# Altium schematic sheet Sheet1.SchDoc
size A4; SheetNumber: 1; SheetTotal: 1
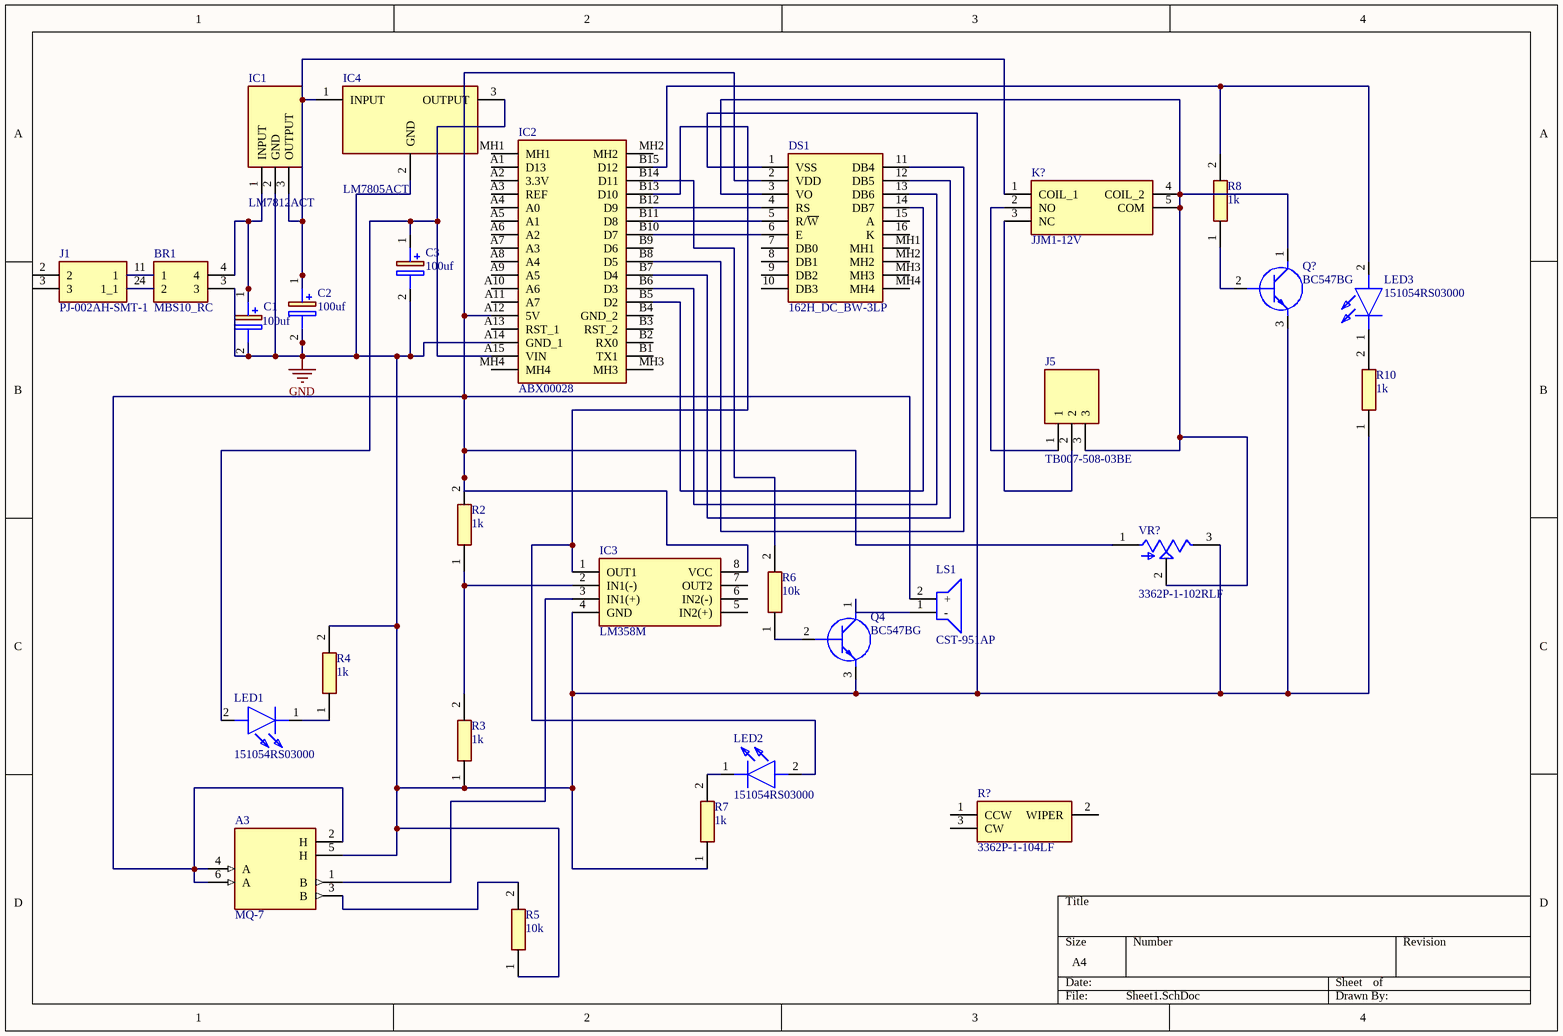
[diagram p0: Sheet1.SchDoc]

## Parts
A3  MQ-7  [XDCR_MQ-7]
BR1  MBS10_RC  [SOP240P690X290-4N]
C1  100uf  [CAPPRD500W65D1250H2700]
C2  100uf  [CAPPRD500W65D1250H2700]
C3  100uf  [CAPPRD500W65D1250H2700]
DS1  162H_DC_BW-3LP  [162HDCBW3LP]
IC1  LM7812ACT  [TO254P470X1016X2019-3P]
IC2  ABX00028  [ABX00028]
IC3  LM358M  [SOIC127P600X175-8N]
IC4  LM7805ACT  [TO254P470X1016X2019-3P]
J1  PJ-002AH-SMT-1  [PJ002AHSMT1]
J5  TB007-508-03BE  [CUI_TB007-508-03BE]
K?  JJM1-12V  [JJM112V]
LED1  151054RS03000  [151054RS03000]
LED2  151054RS03000  [151054RS03000]
LED3  151054RS03000  [151054RS03000]
LS1  CST-951AP  [CST951AP]
Q4  BC547BG  [TO-92_(TO-226)]
Q?  BC547BG  [TO-92_(TO-226)]
R2  1k  [RESAD1987W56L1031D239]
R3  1k  [RESAD1987W56L1031D239]
R4  1k  [RESAD1987W56L1031D239]
R5  10k  [RESAD1987W56L1031D239]
R6  10k  [RESAD1987W56L1031D239]
R7  1k  [RESAD1987W56L1031D239]
R8  1k  [RESAD1987W56L1031D239]
R10  1k  [RESAD1987W56L1031D239]
R?  3362P-1-104LF  [3362P_1]
VR?  3362P-1-102RLF  [TRIM_3362P-1-102RLF]

## Nets
GND: A3.5(H) BR1.3 C1.2(-) C2.2(-) C3.2(-) DS1.1(VSS) IC1.2(GND) IC2.A14(GND_1) IC3.4(GND) IC4.2(GND) Q4.3(E) Q?.3(E) R3.1 R4.2 R5.1 R7.1 R10.1 VR?.3(CW)
NetA3_1: A3.1(B) IC3.3(IN1(+))
NetA3_2: A3.2(H) A3.4(A) A3.6(A) DS1.2(VDD) IC2.A12(5V) IC3.8(VCC) LS1.2(+) R2.2 VR?.1(CCW)
NetA3_3: A3.3(B) R5.2
NetBR1_1: BR1.1 J1.1
NetBR1_2: BR1.2 J1.4(1_1)
NetBR1_4: BR1.4 C1.1(+) IC1.1(INPUT)
NetC2_1: C2.1(+) IC1.3(OUTPUT) IC4.1(INPUT) K?.1(COIL_1)
NetC3_1: C3.1(+) IC2.A15(VIN) IC4.3(OUTPUT) LED1.2(A)
NetDS1_3: DS1.3(VO) J5.3 K?.4(COIL_2) K?.5(COM) Q?.1(C) VR?.2(WIPER)
NetDS1_4: DS1.4(RS) IC2.B12(D9)
NetDS1_5: DS1.5(R/~{W}) IC2.B11(D8)
NetDS1_6: DS1.6(E) IC2.B10(D7)
NetDS1_11: DS1.11(DB4) IC2.B8(D5)
NetDS1_12: DS1.12(DB5) IC2.B7(D4)
NetDS1_13: DS1.13(DB6) IC2.B6(D3)
NetDS1_14: DS1.14(DB7) IC2.B5(D2)
NetIC2_B13: IC2.B13(D10) IC3.1(OUT1) LED2.2(A)
NetIC2_B14: IC2.B14(D11) R6.2
NetIC2_B15: IC2.B15(D12) LED3.2(A) R8.2
NetIC3_2: IC3.2(IN1(-)) R2.1 R3.2
NetJ5_1: J5.1 K?.2(NO)
NetJ5_2: J5.2 K?.3(NC)
NetLED1_1: LED1.1(K) R4.1
NetLED2_1: LED2.1(K) R7.2
NetLED3_1: LED3.1(K) R10.2
NetLS1_1: LS1.1(-) Q4.1(C)
NetQ4_2: Q4.2(B) R6.1
NetQ?_2: Q?.2(B) R8.1

Not connected (* = marked no-connect by the designer): DS1 7(DB0) 8(DB1) 9(DB2) 10(DB3) 15(A) 16(K) MH1 MH2 MH3 MH4; IC2 A1(D13) A2(3.3V) A3(REF) A4(A0) A5(A1) A6(A2) A7(A3) A8(A4) A9(A5) A10(A6) A11(A7) A13(RST_1) B1(TX1) B2(RX0) B3(RST_2) B4(GND_2) B9(D6) MH1 MH2 MH3 MH4; IC3 5(IN2(+)) 6(IN2(-)) 7(OUT2); J1 2 3; R? 1(CCW) 2(WIPER) 3(CW)

## Library data of the parts
A3 = MQ-7: Gas Sensor, High sensitivity to carbon monoxide; MF: Hanwei Electronics Co., Ltd; Price: None; Availability: Unavailable; MP: MQ-7; Package: Package; SnapEDA_Link: https://www.snapeda.com/parts/MQ-7/Hanwei%20Electronics%20Co.,%20Ltd/view-part/5661821/?ref=snap; Check_prices: https://www.snapeda.com/parts/MQ-7/Hanwei%20Electronics%20Co.,%20Ltd/view-part/5661821/?ref=eda; Value: *
BR1 = MBS10_RC: Bridge Rectifier; Manufacturer_Name: Taiwan Semiconductor; Manufacturer_Part_Number: MBS10 RC; Height: 2.9mm; Mouser Part Number: N/A; Mouser Price/Stock: https://www.mouser.com/Search/Refine.aspx?Keyword=N%2FA; Arrow Part Number: MBS10 RC; Arrow Price/Stock: https://www.arrow.com/en/products/mbs10rc/taiwan-semiconductor?region=nac
C1-C3 = EEUTA1E102LB: Capacitor Polarised; Manufacturer_Name: Panasonic; Datasheet Link: http://industrial.panasonic.com/cdbs/www-data/pdf/RDF0000/ABA0000C1212.pdf; Height: 27mm; Manufacturer_Part_Number: EEUTA1E102LB
DS1 = 162H_DC_BW-3LP: Display; Manufacturer_Name: Displaytech; Manufacturer_Part_Number: 162H DC BW-3LP; Datasheet Link: https://www.mouser.com/datasheet/2/1015/162H-DC-BW-3LP-Displaytech-Spec-1664822.pdf; Height: 13.2mm; Mouser Part Number: 758-162HDCBW3LP; Mouser Price/Stock: https://www.mouser.co.uk/ProductDetail/Displaytech/162H-DC-BW-3LP?qs=PzGy0jfpSMu9Pu07wP3dWg%3D%3D
IC1 = LM7812ACT: Integrated Circuit; Manufacturer_Name: onsemi; Datasheet Link: https://datasheet.datasheetarchive.com/originals/distributors/Datasheets_SAMA/704b005d7d2d9ced5864f40b6609c1bc.pdf; Height: 4.7mm; Manufacturer_Part_Number: LM7812ACT; Mouser Part Number: 512-LM7812ACT; Mouser Price/Stock: https://www.mouser.com/Search/Refine.aspx?Keyword=512-LM7812ACT; Arrow Part Number: LM7812ACT; Arrow Price/Stock: https://www.arrow.com/en/products/lm7812act/on-semiconductor
IC2 = ABX00028: Integrated Circuit; Manufacturer_Name: Arduino; Datasheet Link: https://store.arduino.cc/arduino-nano-every; Height: 10mm; Manufacturer_Part_Number: ABX00028; Mouser Part Number: 782-ABX00028; Mouser Price/Stock: https://www.mouser.co.uk/ProductDetail/Arduino/ABX00028?qs=PzGy0jfpSMtit6rnFl8mVg%3D%3D; Arrow Part Number: ABX00028; Arrow Price/Stock: https://www.arrow.com/en/products/abx00028/arduino-corporation?region=nac
IC3 = LM358M: Integrated Circuit; Manufacturer_Name: onsemi; Datasheet Link: https://www.onsemi.com/pub/Collateral/LM358A-D.pdf; Height: 1.75mm; Manufacturer_Part_Number: LM358M; Mouser Part Number: 512-LM358M; Mouser Price/Stock: https://www.mouser.co.uk/ProductDetail/onsemi-Fairchild/LM358M?qs=M37yUtvuNLzx7IpRziQN1g%3D%3D; Arrow Part Number: LM358M; Arrow Price/Stock: https://www.arrow.com/en/products/lm358m/on-semiconductor
IC4 = LM7805ACT: Integrated Circuit; Manufacturer_Name: onsemi; Datasheet Link: https://componentsearchengine.com/Datasheets/2/LM7805ACT.pdf; Height: 4.7mm; Manufacturer_Part_Number: LM7805ACT; Mouser Part Number: 512-LM7805ACT; Mouser Price/Stock: https://www.mouser.co.uk/ProductDetail/ON-Semiconductor-Fairchild/LM7805ACT?qs=VOMQJJE%252BBNlQknJDd4ZVLg%3D%3D; Arrow Part Number: LM7805ACT; Arrow Price/Stock: https://www.arrow.com/en/products/lm7805act/on-semiconductor
J1 = PJ-002AH-SMT-1: Connector; Manufacturer_Name: CUI Devices; Datasheet Link: https://www.cui.com/product/resource/pj-002ah-smt-tr.pdf; Height: 11mm; Manufacturer_Part_Number: PJ-002AH-SMT-1; Mouser Part Number: N/A; Mouser Price/Stock: https://www.mouser.co.uk/ProductDetail/CUI-Inc/PJ-002AH-SMT-1/?qs=WyjlAZoYn53v8l9vpJCO1Q%3D%3D
K? = JJM1-12V: Relay or Contactor; Manufacturer_Name: Panasonic; Datasheet Link: https://www.panasonic-electric-works.com/cps/rde/xbcr/pew_eu_en/ds_61210_en_jjm.pdf; Height: 14.2mm; Manufacturer_Part_Number: JJM1-12V; Mouser Part Number: 769-JJM1-12V; Mouser Price/Stock: https://www.mouser.co.uk/ProductDetail/Panasonic-Industrial-Devices/JJM1-12V?qs=UO%2Fx91QLkSB08I34A9%2FECg%3D%3D; Arrow Part Number: JJM1-12V; Arrow Price/Stock: https://www.arrow.com/en/products/jjm1-12v/panasonic?region=nac
LED1-LED3 = 151054RS03000: LED; Manufacturer_Name: Wurth Elektronik; Datasheet Link: https://componentsearchengine.com/Datasheets/1/151054RS03000.pdf; Height: 12.1mm; Manufacturer_Part_Number: 151054RS03000; Mouser Part Number: 710-151054RS03000; Mouser Price/Stock: https://www.mouser.com/Search/Refine.aspx?Keyword=710-151054RS03000
LS1 = CST-951AP: Loudspeaker or Buzzer; Manufacturer_Name: CUI Devices; Datasheet Link: https://datasheet.datasheetarchive.com/originals/distributors/Datasheets-45/DSA-14132.pdf; Height: 4.5mm; Manufacturer_Part_Number: CST-951AP; Mouser Part Number: 490-CST-951AP; Mouser Price/Stock: https://www.mouser.co.uk/ProductDetail/CUI-Devices/CST-951AP?qs=WyjlAZoYn50BV9%2FINsWxoA%3D%3D; Arrow Part Number: CST-951AP; Arrow Price/Stock: https://www.arrow.com/en/products/cst-951ap/cui-devices?region=nac
Q4 Q? = BC547BG: Transistor BJT NPN; Manufacturer_Name: onsemi; Datasheet Link: https://datasheet.datasheetarchive.com/originals/distributors/Datasheets-23/DSA-455923.pdf; Height: 5.33mm; Manufacturer_Part_Number: BC547BG; Mouser Part Number: N/A; Mouser Price/Stock: http://www.mouser.com/Search/ProductDetail.aspx?qs=NSmgnqlvnz5NIKIycfR5CQ%3d%3d; Arrow Part Number: BC547BG; Arrow Price/Stock: http://www.arrow.com/en/products/bc547bg/on-semiconductor
R2-R8 R10 = RS01A1R000FE12: Resistor; Manufacturer_Name: Vishay; Datasheet Link: http://www.mouser.com/ds/2/427/rsns-226497.pdf; Manufacturer_Part_Number: RS01A1R000FE12; Mouser Part Number: 71-RS01A1R000FE12; Mouser Price/Stock: https://www.mouser.co.uk/ProductDetail/Vishay-Dale/RS01A1R000FE12?qs=pX8%252BLszEE6SqU%2F4VU%252B6gEw%3D%3D; Arrow Part Number: RS01A1R000FE12; Arrow Price/Stock: https://www.arrow.com/en/products/rs01a1r000fe12/vishay?region=nac
R? = 3362P-1-104LF: Resistor; Manufacturer_Name: Bourns; Datasheet Link: http://www.bourns.com/docs/Product-Datasheets/3362.pdf; Manufacturer_Part_Number: 3362P-1-104LF; Mouser Part Number: 652-3362P-1-104LF; Mouser Price/Stock: https://www.mouser.co.uk/ProductDetail/Bourns/3362P-1-104LF?qs=j68eCxbdS5jNo4NAjRLKMA%3D%3D; Arrow Part Number: 3362P-1-104LF; Arrow Price/Stock: https://www.arrow.com/en/products/3362p-1-104lf/bourns?region=europe
VR? = 3362P-1-102RLF: 1 kOhms 0.5W, 1/2W PC Pins Through Hole Trimmer Potentiometer Cermet 1 Turn Top Adjustment; MF: Bourns; Value: *; Check_prices: https://www.snapeda.com/parts/3362P-1-102RLF/Bourns/view-part/1439351/?ref=eda; Availability: Good; Package: 3362P-1 Bourns Inc.; SnapEDA_Link: https://www.snapeda.com/parts/3362P-1-102RLF/Bourns/view-part/1439351/?ref=snap; Purchase-URL: https://pricing.snapeda.com/search/part/3362P-1-102RLF/?ref=eda; Price: None; MP: 3362P-1-102RLF
J5 = TB007-508-03BE: Availability: Unavailable; MP: TB007-508-03BE; Price: None; Value: *; Package: None